# Altium schematic sheet Pulp FMC Sensor Board_4X512Mbits_HyperRam.SchDoc: Pulp FMC Sensor Board_4X512Mbits_HyperRam
size A4; Author: A. Blanco Fontao; CompanyName: ETHZ; DrawnBy: A. Blanco Fontao; Organization: Microelectronics Design Center; Address1: Gloriastrasse 35; Address2: 8092 Zurich; Address3: Switzerland; SheetNumber: 1; SheetTotal: 7
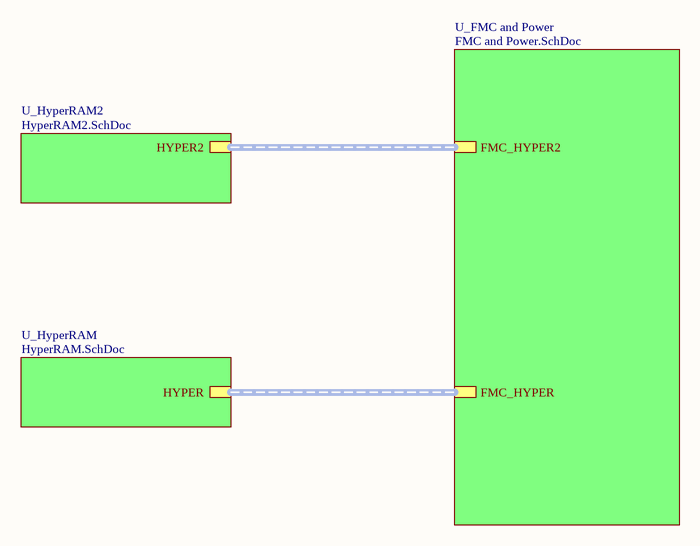
[diagram p0: Pulp FMC Sensor Board_4X512Mbits_HyperRam.SchDoc]

## Sub-sheets
U_FMC and Power = FMC and Power.SchDoc: FMC_HYPER (harness HYPER), FMC_HYPER2
U_HyperRAM = HyperRAM.SchDoc: HYPER (harness HYPER)
U_HyperRAM2 = HyperRAM2.SchDoc: HYPER2

## Buses and harness runs
harness sheet U_FMC and Power/FMC_HYPER2 = sheet U_HyperRAM2/HYPER2
harness sheet U_FMC and Power/FMC_HYPER = sheet U_HyperRAM/HYPER

## Notes on the sheet
- 1
- 2
- 3
- 4
- A
- B
- C
- Project:
- D
- Date:
- Drawing number:
- Rev:
- Format:
- A4 Q
- Drawn by:
- Laboratory:
- Page
- Sheet:
- of
- File: